# Altium project PCB_Project.PrjPcb
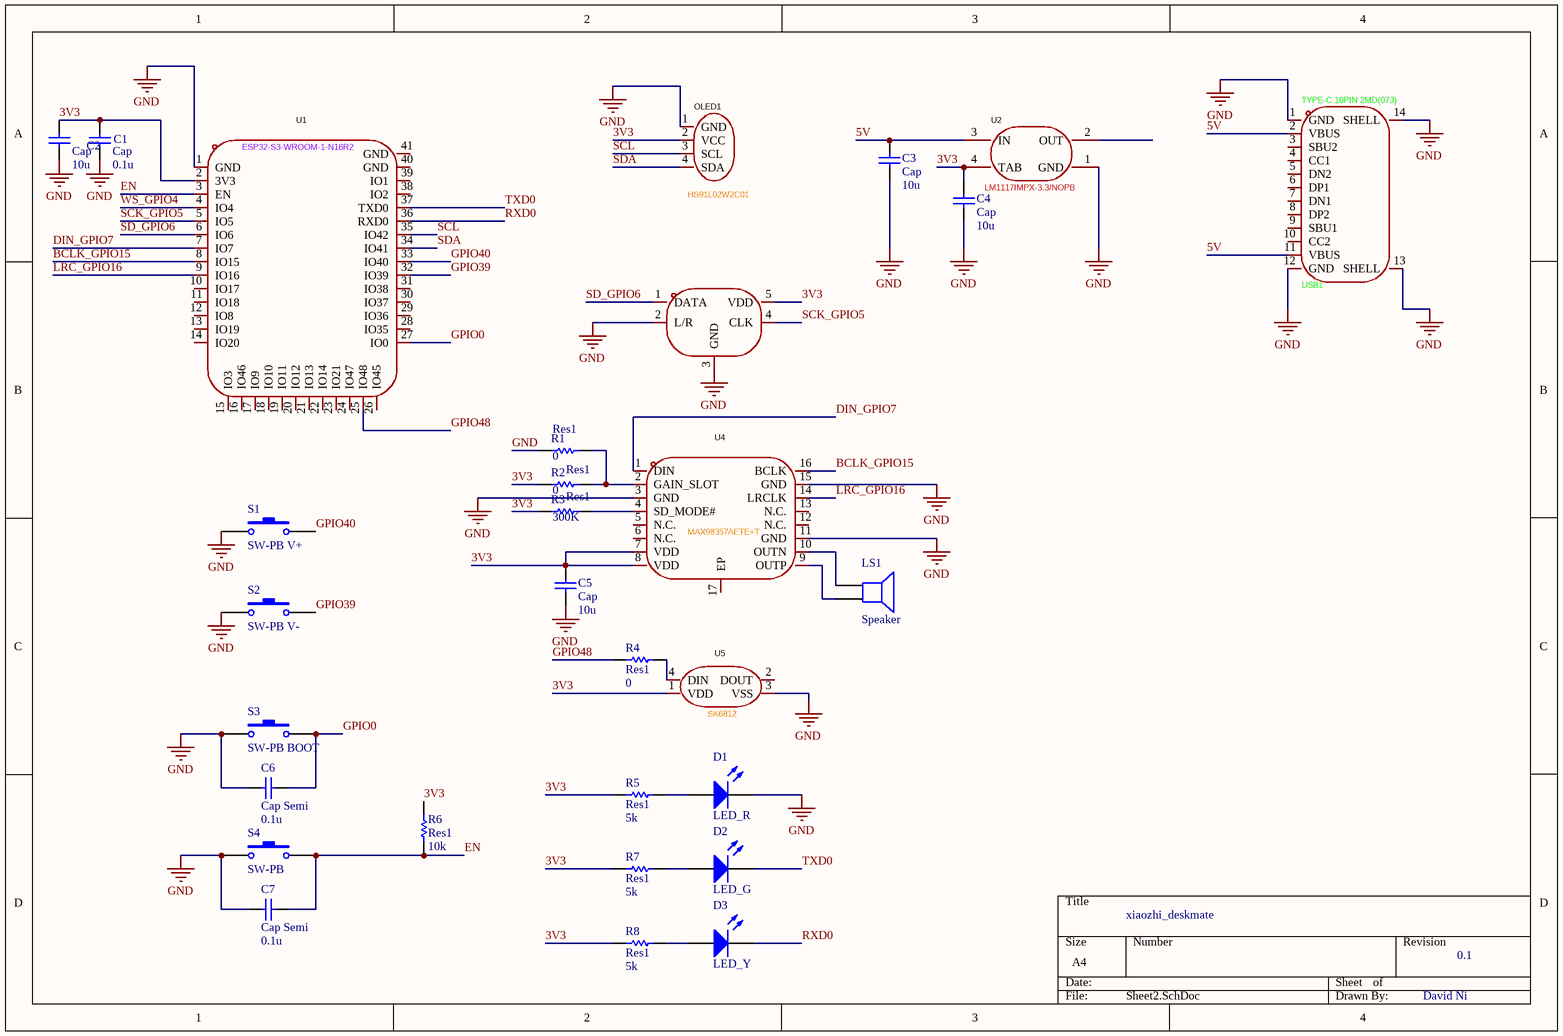
[diagram p0: Sheet2.SchDoc]
1 sheet, 30 parts. Net scope: global (net labels, ports and power ports of the same name join across sheets).
Board file: PCB2.PcbDoc

## Sheet Sheet2.SchDoc
size A4

### Parts
C1  Cap  value 0.1u  [0805C]
C2  Cap  value 10u  [0805C]
C3  Cap  value 10u  [0805C]
C4  Cap  value 10u  [0805C]
C5  Cap  value 10u  [0805C]
C6  Cap Semi  value 0.1u  [0805C]
C7  Cap Semi  value 0.1u  [0805C]
D1  LED_R  [LED0805-R-RD]
D2  LED_G  [LED0805-R-RD]
D3  LED_Y  [LED0805-R-RD]
LS1  Speaker  [spk_11x15]
OLED1  HS91L02W2C01  [OLED-TH_L38.0-W12.0_HS91L02W2C01]
R1  Res1  value 0  [0805R]
R2  Res1  value 0  [0805R]
R3  Res1  value 300K  [0805R]
R4  Res1  value 0  [0805R]
R5  Res1  value 5k  [0805R]
R6  Res1  value 10k  [0805R]
R7  Res1  value 5k  [0805R]
R8  Res1  value 5k  [0805R]
S1  SW-PB V+  [SW_side_click_6x3x3]
S2  SW-PB V-  [SW_side_click_6x3x3]
S3  SW-PB BOOT  [SW_side_click_6x3x3]
S4  SW-PB  [SW_side_click_6x3x3]
U1  ESP32-S3-WROOM-1-N16R2  [WIRELM-SMD_ESP32-S3-WROOM-1]
U2  LM1117IMPX-3.3/NOPB  [SOT-223_L6.5-W3.5-P2.30-LS7.0-BR]
U4  MAX98357AETE+T  [TQFN-16_L3.0-W3.0-P0.50-BL-EP1.5]
U5  SK6812  [LED-SMD_4P-L5.0-W5.0-LS5.4-TL-1]
U?  MSM261D3526Z1CM  [MIC-SMD_8P-L4.0-W3.0-P1.00-BR]  (value not drawn)
USB1  TYPE-C 16PIN 2MD(073)  [USB-C-SMD_TYPE-C-6PIN-2MD-073]

### Nets
GND: C1.1 C2.1 C3.1 C4.1 C5.1 C6.1 C7.1 D1.2(K) OLED1.1(GND) R1.1 S1.1 S2.1 S3.1 S4.1 U1.1(GND) U2.1(GND) U4.3(GND) U4.11(GND) U4.15(GND) U5.3(VSS) U?.2(L/R) U?.3(GND) USB1.1(GND) USB1.12(GND) USB1.13(SHELL) USB1.14(SHELL)
3V3: C1.2 C2.2 C4.2 C5.2 OLED1.2(VCC) R2.1 R3.1 R5.1 R6.2 R7.1 R8.1 U1.2(3V3) U2.4(TAB) U4.7(VDD) U4.8(VDD) U5.1(VDD) U?.5(VDD)
5V: C3.2 U2.3(IN) USB1.2(VBUS) USB1.11(VBUS)
BCLK_GPIO15: U1.8(IO15) U4.16(BCLK)
DIN_GPIO7: U1.7(IO7) U4.1(DIN)
EN: C7.2 R6.1 S4.2 U1.3(EN)
GPIO0: C6.2 S3.2 U1.27(IO0)
GPIO39: S2.2 U1.32(IO39)
GPIO40: S1.2 U1.33(IO40)
GPIO48: R4.1 U1.25(IO48)
LRC_GPIO16: U1.9(IO16) U4.14(LRCLK)
RXD0: D3.2(K) U1.36(RXD0)
SCK_GPIO5: U1.5(IO5) U?.4(CLK)
SCL: OLED1.3(SCL) U1.35(IO42)
SD_GPIO6: U1.6(IO6) U?.1(DATA)
SDA: OLED1.4(SDA) U1.34(IO41)
TXD0: D2.2(K) U1.37(TXD0)
WS_GPIO4: U1.4(IO4)
NetD1_1: D1.1(A) R5.2
NetD2_1: D2.1(A) R7.2
NetD3_1: D3.1(A) R8.2
NetLS1_1: LS1.1 U4.10(OUTN)
NetLS1_2: LS1.2 U4.9(OUTP)
NetR1_2: R1.2 R2.2 U4.2(GAIN_SLOT)
NetR3_2: R3.2 U4.4(SD_MODE#)
NetR4_2: R4.2 U5.4(DIN)

Not connected (* = marked no-connect by the designer): U1 10(IO17) 11(IO18) 12(IO8) 13(IO19) 14(IO20) 15(IO3) 16(IO46) 17(IO9) 18(IO10) 19(IO11) 20(IO12) 21(IO13) 22(IO14) 23(IO21) 24(IO47) 26(IO45) 28(IO35) 29(IO36) 30(IO37) 31(IO38) 38(IO2) 39(IO1) 40(GND) 41(GND); U2 2(OUT); U4 5(N.C.) 6(N.C.) 12(N.C.) 13(N.C.) 17(EP); U5 2(DOUT); USB1 3(SBU2) 4(CC1) 5(DN2) 6(DP1) 7(DN1) 8(DP2) 9(SBU1) 10(CC2)

### Notes on the sheet
- xiaozhi_deskmate
- 0.1
- David Ni

### Library data of the parts
C1-C5 = Cap: Capacitor; Published: 8-Jun-2000; LatestRevisionDate: 17-Jul-2002; LatestRevisionNote: Re-released for DXP Platform.; PackageReference: RAD-0.3; Publisher: Altium Limited; PackageDescription: Radial Cap, Thru-Hole; 2 Leads; 0.3 in Pin Spacing
C6 C7 = Cap Semi: Capacitor (Semiconductor SIM Model); Published: 8-Jun-2000; LatestRevisionDate: 29-May-2009; LatestRevisionNote: IPC-7351 Footprint Added.; PackageReference: C1206; Publisher: Altium Limited; PackageDescription: Chip Capacitor
D1-D3 = LED0: Typical INFRARED GaAs LED; Published: 8-Jun-2000; LatestRevisionDate: 08-Jul-2005; LatestRevisionNote: Mech Layer 1 removed.; PackageReference: LED-0; Publisher: Altium Limited; PackageDescription: LED; 2 Leads
LS1 = Speaker: Loudspeaker; Published: 24-Mar-1999; LatestRevisionDate: 17-Jul-2002; LatestRevisionNote: Re-released for DXP Platform.; PackageReference: PIN2; Publisher: Altium Limited
OLED1 = HS91L02W2C01: Manufacturer: HS(汉昇); Add into BOM: yes; Main Control Chip: SSD1306; Interface Type: I2C; Pixel Resolution: 128x32; Symbol: HS91L02W2C01; Device: HS91L02W2C01; LCSC Part Name: 0.91寸OLED显示屏白光IIC; Supplier Part: C5248081; Manufacturer Part: HS91L02W2C01; Supplier Footprint: -; JLCPCB Part Class: Extended Part; Datasheet: https://atta.szlcsc.com/upload/public/pdf/source/20230727/C3E43C8E3DDA847F5681FEE7D95C153D.pdf; Supplier: LCSC; Convert to PCB: yes; Size: 0.91; Operating Temperature: -40℃~+70℃
R1-R8 = Res1: Resistor; Published: 8-Jun-2000; LatestRevisionDate: 17-Jul-2002; LatestRevisionNote: Re-released for DXP Platform.; PackageReference: AXIAL-0.3; Publisher: Altium Limited; PackageDescription: Axial Device, Thru-Hole; 2 Leads; 0.3 in Pin Spacing
S1-S4 = SW-PB: Switch; Published: 24-Mar-1999; LatestRevisionDate: 17-Jul-2002; LatestRevisionNote: Re-released for DXP Platform.; PackageReference: SPST-2; Publisher: Altium Limited; PackageDescription: Switch; 2 Leads
U1 = ESP32-S3-WROOM-1-N16R2: Manufacturer: ESPRESSIF(乐鑫); Symbol: ESP32-S3-WROOM-1(N16R2); Add into BOM: yes; Device: ESP32-S3-WROOM-1-N16R2; LCSC Part Name: 通用型Wi-Fi+低功耗蓝牙MCU模组; Supplier Part: C2913205; Manufacturer Part: ESP32-S3-WROOM-1-N16R2; Supplier Footprint: SMD,18x25.5mm; JLCPCB Part Class: Extended Part; Datasheet: https://atta.szlcsc.com/upload/public/pdf/source/20220628/A2AC12B3C87735CAEB7EBE2DBE80936C.pdf; Supplier: LCSC; Convert to PCB: yes
U2 = LM1117IMPX-3.3/NOPB: Manufacturer: TI(德州仪器); Add into BOM: yes; Output Type: 固定; Maximum Input Voltage: 15V; Output Voltage: 3.3V; MAX Output Current: 800mA; Power Supply Rejection Ratio (PSRR): 75dB@(120Hz); Dropout Voltage: 1.2V@(800mA); standby current: 5mA; Output Polarity: 正极; Number of Outputs: 1; Symbol: LM1117IMPX-3.3/NOPB; Device: LM1117IMPX-3.3/NOPB; LCSC Part Name: 输入20V 输出3.3V 800mA; Supplier Part: C23984; Manufacturer Part: LM1117IMPX-3.3/NOPB; Supplier Footprint: SOT-223; JLCPCB Part Class: Extended Part; Datasheet: http://www.ti.com/cn/lit/gpn/lm1117; Supplier: LCSC; Convert to PCB: yes; Operating Temperature: -40℃~+125℃
U4 = MAX98357AETE+T: Manufacturer: ADI(亚德诺)/MAXIM(美信); Add into BOM: yes; Speaker Channels: 单声道; Output Power: 3.2Wx2@4Ω; Supply Voltage: 2.5V~5.5V; Symbol: MAX98357AETE+T; Device: MAX98357AETE+T; LCSC Part Name: 微型、低成本、PCM 类 D 级放大器具有 AB 级性能; Supplier Part: C910544; Manufacturer Part: MAX98357AETE+T; Supplier Footprint: TQFN-16-EP(3x3); JLCPCB Part Class: Extended Part; Datasheet: https://atta.szlcsc.com/upload/public/pdf/source/20210106/C910544_CB6DE4B2CEE254A72E6BDB40E718D281.pdf; Supplier: LCSC; Convert to PCB: yes; Type of Power Amplifier: -; Operating Temperature: -40℃~+85℃
U5 = SK6812_C5378720: Manufacturer: 欧思科光电; Add into BOM: yes; Symbol: SK6812_C5378720; Device: SK6812_C5378720; LCSC Part Name: SK6812; Supplier Part: C5378720; Manufacturer Part: SK6812; Supplier Footprint: SMD-4P,5.4x5mm; JLCPCB Part Class: Extended Part; Datasheet: https://atta.szlcsc.com/upload/public/pdf/source/20230330/4C8DEAC234E2ECEEE596F166E9B92CF0.pdf; Supplier: LCSC; Convert to PCB: yes
U? = MSM261D3526Z1CM: Manufacturer: MEMS(敏芯微); Symbol: MSM261S4030H0R; Add into BOM: yes; Device: MSM261S4030H0R; LCSC Part Name: MSM261S4030H0R; Supplier Part: C2840615; Manufacturer Part: MSM261S4030H0R; Supplier Footprint: -; JLCPCB Part Class: Extended Part; Datasheet: https://atta.szlcsc.com/upload/public/pdf/source/20210707/C2840615_6AE5BCBEE3224C96A8195D5DC270E7C8.pdf; Supplier: LCSC; Convert to PCB: yes
USB1 = TYPE-C 16PIN 2MD(073): Manufacturer: SHOU HAN(首韩); Add into BOM: yes; Gender: 母; Number of Contacts: 16P; Number of Ports: 1; Current Rating - Power (Max): 5A; Rated Voltage (Max): 5V; Connect-Disconnect Life: 5千次; Core Colour: 黑色; Symbol: TYPE-C 16PIN 2MD(073); Device: TYPE-C 16PIN 2MD(073); LCSC Part Name: Type-C 母 卧贴; Supplier Part: C2765186; Manufacturer Part: TYPE-C 16PIN 2MD(073); Supplier Footprint: SMD; JLCPCB Part Class: Extended Part; Datasheet: https://atta.szlcsc.com/upload/public/pdf/source/20211123/39B17C16241EAC15C5E277BDA434118E.pdf; Supplier: LCSC; Convert to PCB: yes; Connector Type: Type-C; Standard: USB 3.1; Mounting Style: 卧贴; Operating Temperature Range: -25℃~+85℃